# EAGLE schematic ProjV1 (EAGLE 9.6.2)
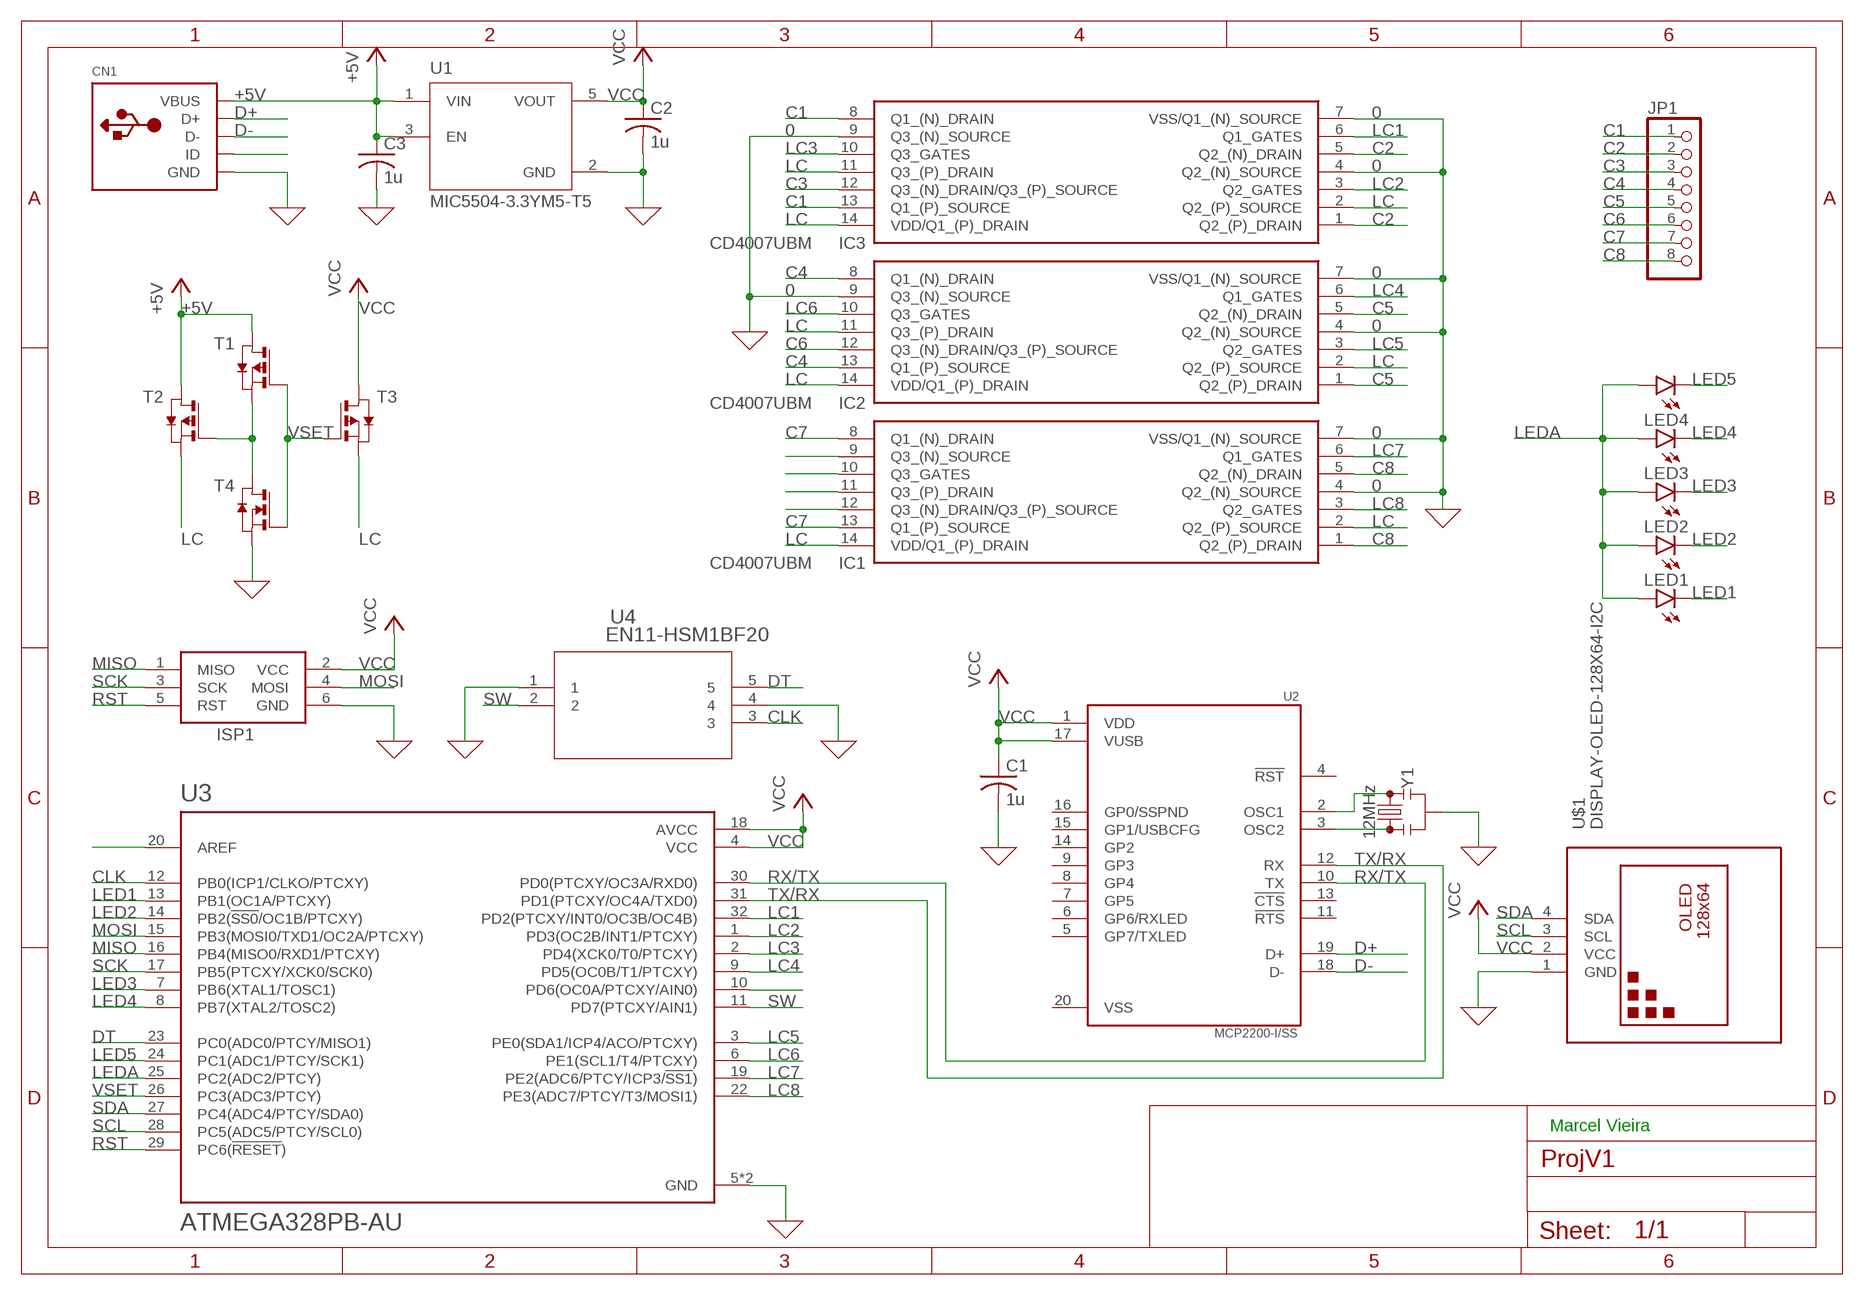
[diagram p0: schematic, sheet 1]

## Parts
C1  1u  C-USC0805  [C0805]
C2  1u  C-USC0805  [C0805]
C3  1u  C-USC0805  [C0805]
CN1  USBMINIB  [USB-MINIB]
IC1  CD4007UBM  [SOIC127P600X175-14N]
IC2  CD4007UBM  [SOIC127P600X175-14N]
IC3  CD4007UBM  [SOIC127P600X175-14N]
ISP1  AVRISP-6  [AVRISP]
JP1  PINHD-1X8-3.5MM  [1X08-3.5MM]
LED1  LEDCHIP-LED0805  [CHIP-LED0805]
LED2  LEDCHIP-LED0805  [CHIP-LED0805]
LED3  LEDCHIP-LED0805  [CHIP-LED0805]
LED4  LEDCHIP-LED0805  [CHIP-LED0805]
LED5  LEDCHIP-LED0805  [CHIP-LED0805]
T1  PMOSSOT23  [SOT-23]
T2  PMOSSOT23  [SOT-23]
T3  PMOSSOT23  [SOT-23]
T4  NMOSSOT23  [SOT-23]
U1  MIC5504-3.3YM5-T5  [SOT95P280X145-5N]
U2  MCP2200-I/SS  [SOP65P780X200-20N]
U3  ATMEGA328PB-AU  [QFP80P900X900X120-32N]
U4  EN11-HSM1BF20  [EN11-HSM_TTE]
U$1  DISPLAY-OLED-128X64-I2C  [DISPLAY-OLED-128X64-I2C]
Y1  12MHz  RESONATOR-16MHZSMD_3.2X1.3  [RESONATOR-SMD-3.2X1.3]

## Nets
0: C1.2 C2.2 C3.2 CN1.GND IC1.4(Q2_(N)_SOURCE) IC1.7(VSS/Q1_(N)_SOURCE) IC2.4(Q2_(N)_SOURCE) IC2.7(VSS/Q1_(N)_SOURCE) IC2.9(Q3_(N)_SOURCE) IC3.4(Q2_(N)_SOURCE) IC3.7(VSS/Q1_(N)_SOURCE) IC3.9(Q3_(N)_SOURCE) ISP1.6(GND) T4.2(S) U1.2(GND) U3.5(GND) U3.21(GND) U4.1 U4.4 U$1.1(GND) Y1.2 ; supply symbol labelled GND
+5V: C3.1 CN1.VBUS T1.1(D) T2.1(D) U1.1(VIN) U1.3(EN)
C1: IC3.8(Q1_(N)_DRAIN) IC3.13(Q1_(P)_SOURCE) JP1.1
C2: IC3.1(Q2_(P)_DRAIN) IC3.5(Q2_(N)_DRAIN) JP1.2
C3: IC3.12(Q3_(N)_DRAIN/Q3_(P)_SOURCE) JP1.3
C4: IC2.8(Q1_(N)_DRAIN) IC2.13(Q1_(P)_SOURCE) JP1.4
C5: IC2.1(Q2_(P)_DRAIN) IC2.5(Q2_(N)_DRAIN) JP1.5
C6: IC2.12(Q3_(N)_DRAIN/Q3_(P)_SOURCE) JP1.6
C7: IC1.8(Q1_(N)_DRAIN) IC1.13(Q1_(P)_SOURCE) JP1.7
C8: IC1.1(Q2_(P)_DRAIN) IC1.5(Q2_(N)_DRAIN) JP1.8
CLK: U3.12(PB0(ICP1/CLKO/PTCXY)) U4.3
D+: CN1.D+ U2.19(D+)
D-: CN1.D- U2.18(D-)
DT: U3.23(PC0(ADC0/PTCY/MISO1)) U4.5
LC: IC1.2(Q2_(P)_SOURCE) IC1.14(VDD/Q1_(P)_DRAIN) IC2.2(Q2_(P)_SOURCE) IC2.11(Q3_(P)_DRAIN) IC2.14(VDD/Q1_(P)_DRAIN) IC3.2(Q2_(P)_SOURCE) IC3.11(Q3_(P)_DRAIN) IC3.14(VDD/Q1_(P)_DRAIN) T2.2(S) T3.2(S)
LC1: IC3.6(Q1_GATES) U3.32(PD2(PTCXY/INT0/OC3B/OC4B))
LC2: IC3.3(Q2_GATES) U3.1(PD3(OC2B/INT1/PTCXY))
LC3: IC3.10(Q3_GATES) U3.2(PD4(XCK0/T0/PTCXY))
LC4: IC2.6(Q1_GATES) U3.9(PD5(OC0B/T1/PTCXY))
LC5: IC2.3(Q2_GATES) U3.3(PE0(SDA1/ICP4/ACO/PTCXY))
LC6: IC2.10(Q3_GATES) U3.6(PE1(SCL1/T4/PTCXY))
LC7: IC1.6(Q1_GATES) U3.19(PE2(ADC6/PTCY/ICP3/!SS1!))
LC8: IC1.3(Q2_GATES) U3.22(PE3(ADC7/PTCY/T3/MOSI1))
LED1: LED1.C U3.13(PB1(OC1A/PTCXY))
LED2: LED2.C U3.14(PB2(!SS0!/OC1B/PTCXY))
LED3: LED3.C U3.7(PB6(XTAL1/TOSC1))
LED4: LED4.C U3.8(PB7(XTAL2/TOSC2))
LED5: LED5.C U3.24(PC1(ADC1/PTCY/SCK1))
LEDA: LED1.A LED2.A LED3.A LED4.A LED5.A U3.25(PC2(ADC2/PTCY))
MISO: ISP1.1(MISO) U3.16(PB4(MISO0/RXD1/PTCXY))
MOSI: ISP1.4(MOSI) U3.15(PB3(MOSI0/TXD1/OC2A/PTCXY))
N$1: IC1.9(Q3_(N)_SOURCE)
N$2: IC1.10(Q3_GATES)
N$3: IC1.11(Q3_(P)_DRAIN)
N$4: U3.10(PD6(OC0A/PTCXY/AIN0))
N$5: IC1.12(Q3_(N)_DRAIN/Q3_(P)_SOURCE)
N$6: U2.2(OSC1) Y1.1
N$8: CN1.ID
N$9: T1.2(S) T2.3(G) T4.1(D)
N$14: U2.3(OSC2) Y1.3
N$30: U3.20(AREF)
RST: ISP1.5(RST) U3.29(PC6(!RESET!))
RX/TX: U2.10(TX) U3.30(PD0(PTCXY/OC3A/RXD0))
SCK: ISP1.3(SCK) U3.17(PB5(PTCXY/XCK0/SCK0))
SCL: U3.28(PC5(ADC5/PTCY/SCL0)) U$1.3(SCL)
SDA: U3.27(PC4(ADC4/PTCY/SDA0)) U$1.4(SDA)
SW: U3.11(PD7(PTCXY/AIN1)) U4.2
TX/RX: U2.12(RX) U3.31(PD1(PTCXY/OC4A/TXD0))
VCC: C1.1 C2.1 ISP1.2(VCC) T3.1(D) U1.5(VOUT) U2.1(VDD) U2.17(VUSB) U3.4(VCC) U3.18(AVCC) U$1.2(VCC)
VSET: T1.3(G) T3.3(G) T4.3(G) U3.26(PC3(ADC3/PTCY))
Unconnected: U2.4(!RST) U2.5(GP7/TXLED) U2.6(GP6/RXLED) U2.7(GP5) U2.8(GP4) U2.9(GP3) U2.11(!RTS) U2.13(!CTS) U2.14(GP2) U2.15(GP1/USBCFG) U2.16(GP0/SSPND)

## Notes on the sheet
- Marcel Vieira

## Power pins joined to a net without a drawn wire
VSS: U2.20(VSS)

## Library data of the parts
C1-C3 = rcl:C-US: CAPACITOR, American symbol; SPICEPREFIX: C
CN1 = adafruit:USB: USB Connectors USBMINIB - Surface Mount Female Mini-B USB Connector 4UConnector: 06564 By microbuilder.eu Thru-hole RA Female Mini-B USB Connector 4UConnector: 18732 By ladyada.net
IC1-IC3 = CD4007UBM:CD4007UBM: Texas Instruments CD4007UBM Inverter, 3 18 V, 14-Pin SOIC Source: Datasheet <http://www.ti.com/lit/gpn/cd4007ub>; ARROW_PART_NUMBER: CD4007UBM; ARROW_PRICE-STOCK: https://www.arrow.com/en/products/cd4007ubm/texas-instruments; DESCRIPTION: Texas Instruments CD4007UBM Inverter, 3 18 V, 14-Pin SOIC; HEIGHT: 1.75mm; MANUFACTURER_NAME: Texas Instruments; MANUFACTURER_PART_NUMBER: CD4007UBM; MOUSER_PART_NUMBER: 595-CD4007UBM; MOUSER_PRICE-STOCK: https://www.mouser.co.uk/ProductDetail/Texas-Instruments/CD4007UBM?qs=LfG3tU9ud8BhOMkMTdqqtw%3D%3D
ISP1 = adafruit:AVRISP: AVR ISP HEADER Standard 6 pin header for AVR programming
JP1 = adafruit:PINHD-1X8: PIN HEADER
LED1-LED5 = led:LED: LED OSRAM: - CHIPLED LG R971, LG N971, LY N971, LG Q971, LY Q971, LO R971, LY R971 LH N974, LH R974 LS Q976, LO Q976, LY Q976 LO Q996 - Hyper CHIPLED LW Q18S LB Q993, LB Q99A, LB R99A - SideLED LS A670, LO A670, LY A670, LG A670, LP A670 LB A673, LV A673, LT A673, LW A673 LH A674 LY A675 LS A676, LA A676, LO A676, LY A676, LW A676 LS A679, LY A679, LG A679 - Hyper Micro SIDELED® LS Y876, LA Y876, LO Y876, LY Y876 LT Y87S - SmartLED LW L88C, LW L88S LB L89C, LB L89S, LG L890 LS L89K, LO L89K, LY L89K LS L896, LA L896, LO L896, LY L896 - TOPLED LS T670, LO T670, LY T670, LG T670, LP T670 LSG T670, LSP T670, LSY T670, LOP T670, LYG T670 LG T671, LOG T671, LSG T671 LB T673, LV T673, LT T673, LW T673 LH T674 LS T676, LA T676, LO T676, LY T676, LB T676, LH T676, LSB T676, LW T676 LB T67C, LV T67C, LT T67C, LS T67K, LO T67K, LY T67K, LW E67C LS E67B, LA E67B, LO E67B, LY E67B, LB E67C, LV E67C, LT E67C LW T67C LS T679, LY T679, LG T679 LS T770, LO T770, LY T770, LG T770, LP T770 LB T773, LV T773, LT T773, LW T773 LH T774 LS E675, LA E675, LY E675, LS T675 LS T776, LA T776, LO T776, LY T776, LB T776 LHGB T686 LT T68C, LB T68C - Hyper Mini TOPLED® LB M676 - Mini TOPLED Santana® LG M470 LS M47K, LO M47K, LY M47K Source: http://www.osram.convergy.de LUXEON: - LUMILED® LXK2-PW12-R00, LXK2-PW12-S00, LXK2-PW14-U00, LXK2-PW14-V00 LXK2-PM12-R00, LXK2-PM12-S00, LXK2-PM14-U00 LXK2-PE12-Q00, LXK2-PE12-R00, LXK2-PE12-S00, LXK2-PE14-T00, LXK2-PE14-U00 LXK2-PB12-K00, LXK2-PB12-L00, LXK2-PB12-M00, LXK2-PB14-N00, LXK2-PB14-P00, LXK2-PB14-Q00 LXK2-PR12-L00, LXK2-PR12-M00, LXK2-PR14-Q00, LXK2-PR14-R00 LXK2-PD12-Q00, LXK2-PD12-R00, LXK2-PD12-S00 LXK2-PH12-R00, LXK2-PH12-S00 LXK2-PL12-P00, LXK2-PL12-Q00, LXK2-PL12-R00 Source: www.luxeon.com KINGBRIGHT: KA-3528ASYC Source: www.kingbright.com
T1-T3 = zetex:PMOSSOT23: MOS FET; OC_FARNELL: unknown; OC_NEWARK: unknown
T4 = zetex:NMOSSOT23: MOS FET; OC_FARNELL: unknown; OC_NEWARK: unknown
U1 = MIC5504-3.3YM5-T5:MIC5504-3.3YM5-T5: Linear Voltage Regulator IC 1 Output 300mA SOT-23-5 Check prices <https://pricing.snapeda.com/parts/MIC5504-3.3YM5-T5/Microchip/view-part?ref=eda>; AVAILABILITY: Good; DESCRIPTION: Linear Voltage Regulator IC 1 Output 300mA SOT-23-5; MF: Microchip; MP: MIC5504-3.3YM5-T5; PACKAGE: SOT-23-5 Microchip; PRICE: None; PURCHASE-URL: https://pricing.snapeda.com/search/part/MIC5504-3.3YM5-T5/?ref=eda
U2 = MCP2200-I_SS:MCP2200-I/SS: MCP2200 Series 5.5 V 8 Channel USB to UART Serial Converter SMT- SSOP-20LD Check prices <https://pricing.snapeda.com/search/part/MCP2200-I/SS/?ref=eda>; AVAILABILITY: Good; DESCRIPTION: USB Bridge, USB to UART USB 2.0 UART Interface 20-SSOP; MF: Microchip; MP: MCP2200-I/SS; PACKAGE: SSOP-20 Microchip; PRICE: None; PURCHASE-URL: https://pricing.snapeda.com/search/part/MCP2200-I/SS/?ref=eda
U3 = ATMEGA328PB-AU:ATMEGA328PB-AU: ATmega Series 20 MHz 32 KB Flash 2 KB SRAM 8-Bit Microcontroller - TQFP-32 Check prices <https://pricing.snapeda.com/search/part/ATMEGA328PB-AU/?ref=eda>; AVAILABILITY: Good; DESCRIPTION: 8-bit Microcontrollers - MCU ATMEGA328PB 20MHZ IND TEMP; MF: Microchip Technology / Atmel; MP: ATMEGA328PB-AU; PACKAGE: None; PRICE: None; PURCHASE-URL: https://pricing.snapeda.com/search/part/ATMEGA328PB-AU/?ref=eda
U4 = EN11-HSM1BF20:EN11-HSM1BF20; MANUFACTURER_PART_NUMBER: EN11-HSM1BF20; SOURCELIBRARY: TTELECTRONICS_2018-05-01A; VENDOR: TT Electronics
U$1 = diy-modules:DISPLAY-OLED-128X64-I2C: 128x64 Dot Matrix OLED Module based on SSD1306 chip Variant with I2C interface More details available here: http://www.instructables.com/id/Monochrome-096-i2c-OLED-display-with-arduino-SSD13/ SSD1306 datasheet: https://cdn-shop.adafruit.com/datasheets/SSD1306.pdf Click here to find device on ebay.com <http://www.ebay.com/sch/oled+display+128x64+iic> Note: There are two variants: I2C and SPI. Search for the proper version.
Y1 = SparkFun-Clocks:RESONATOR-16MHZ: 16MHz Resonator Digikey Example <http://www.digikey.com/product-detail/en/murata-electronics-north-america/CSTCE16M0V53-R0/490-1198-1-ND/584635> Frequency: 16MHz Frequency Stability: ±0.3% Frequency Tolerance: ±0.5% Capacitance: 15pF SparkFun Products SparkFun OpenLog <https://www.sparkfun.com/products/13712> SparkFun MicroView - OLED Arduino Module <https://www.sparkfun.com/products/12923>; PROD_ID: XTAL-08900; VALUE: 16MHz